# Altium schematic sheet BI3.SchDoc
size 420 x 297 mm; DocumentNumber: 8; SheetNumber: 8; SheetTotal: 13; DecimalNumber: СНАБ.468222.001 ЭЗ
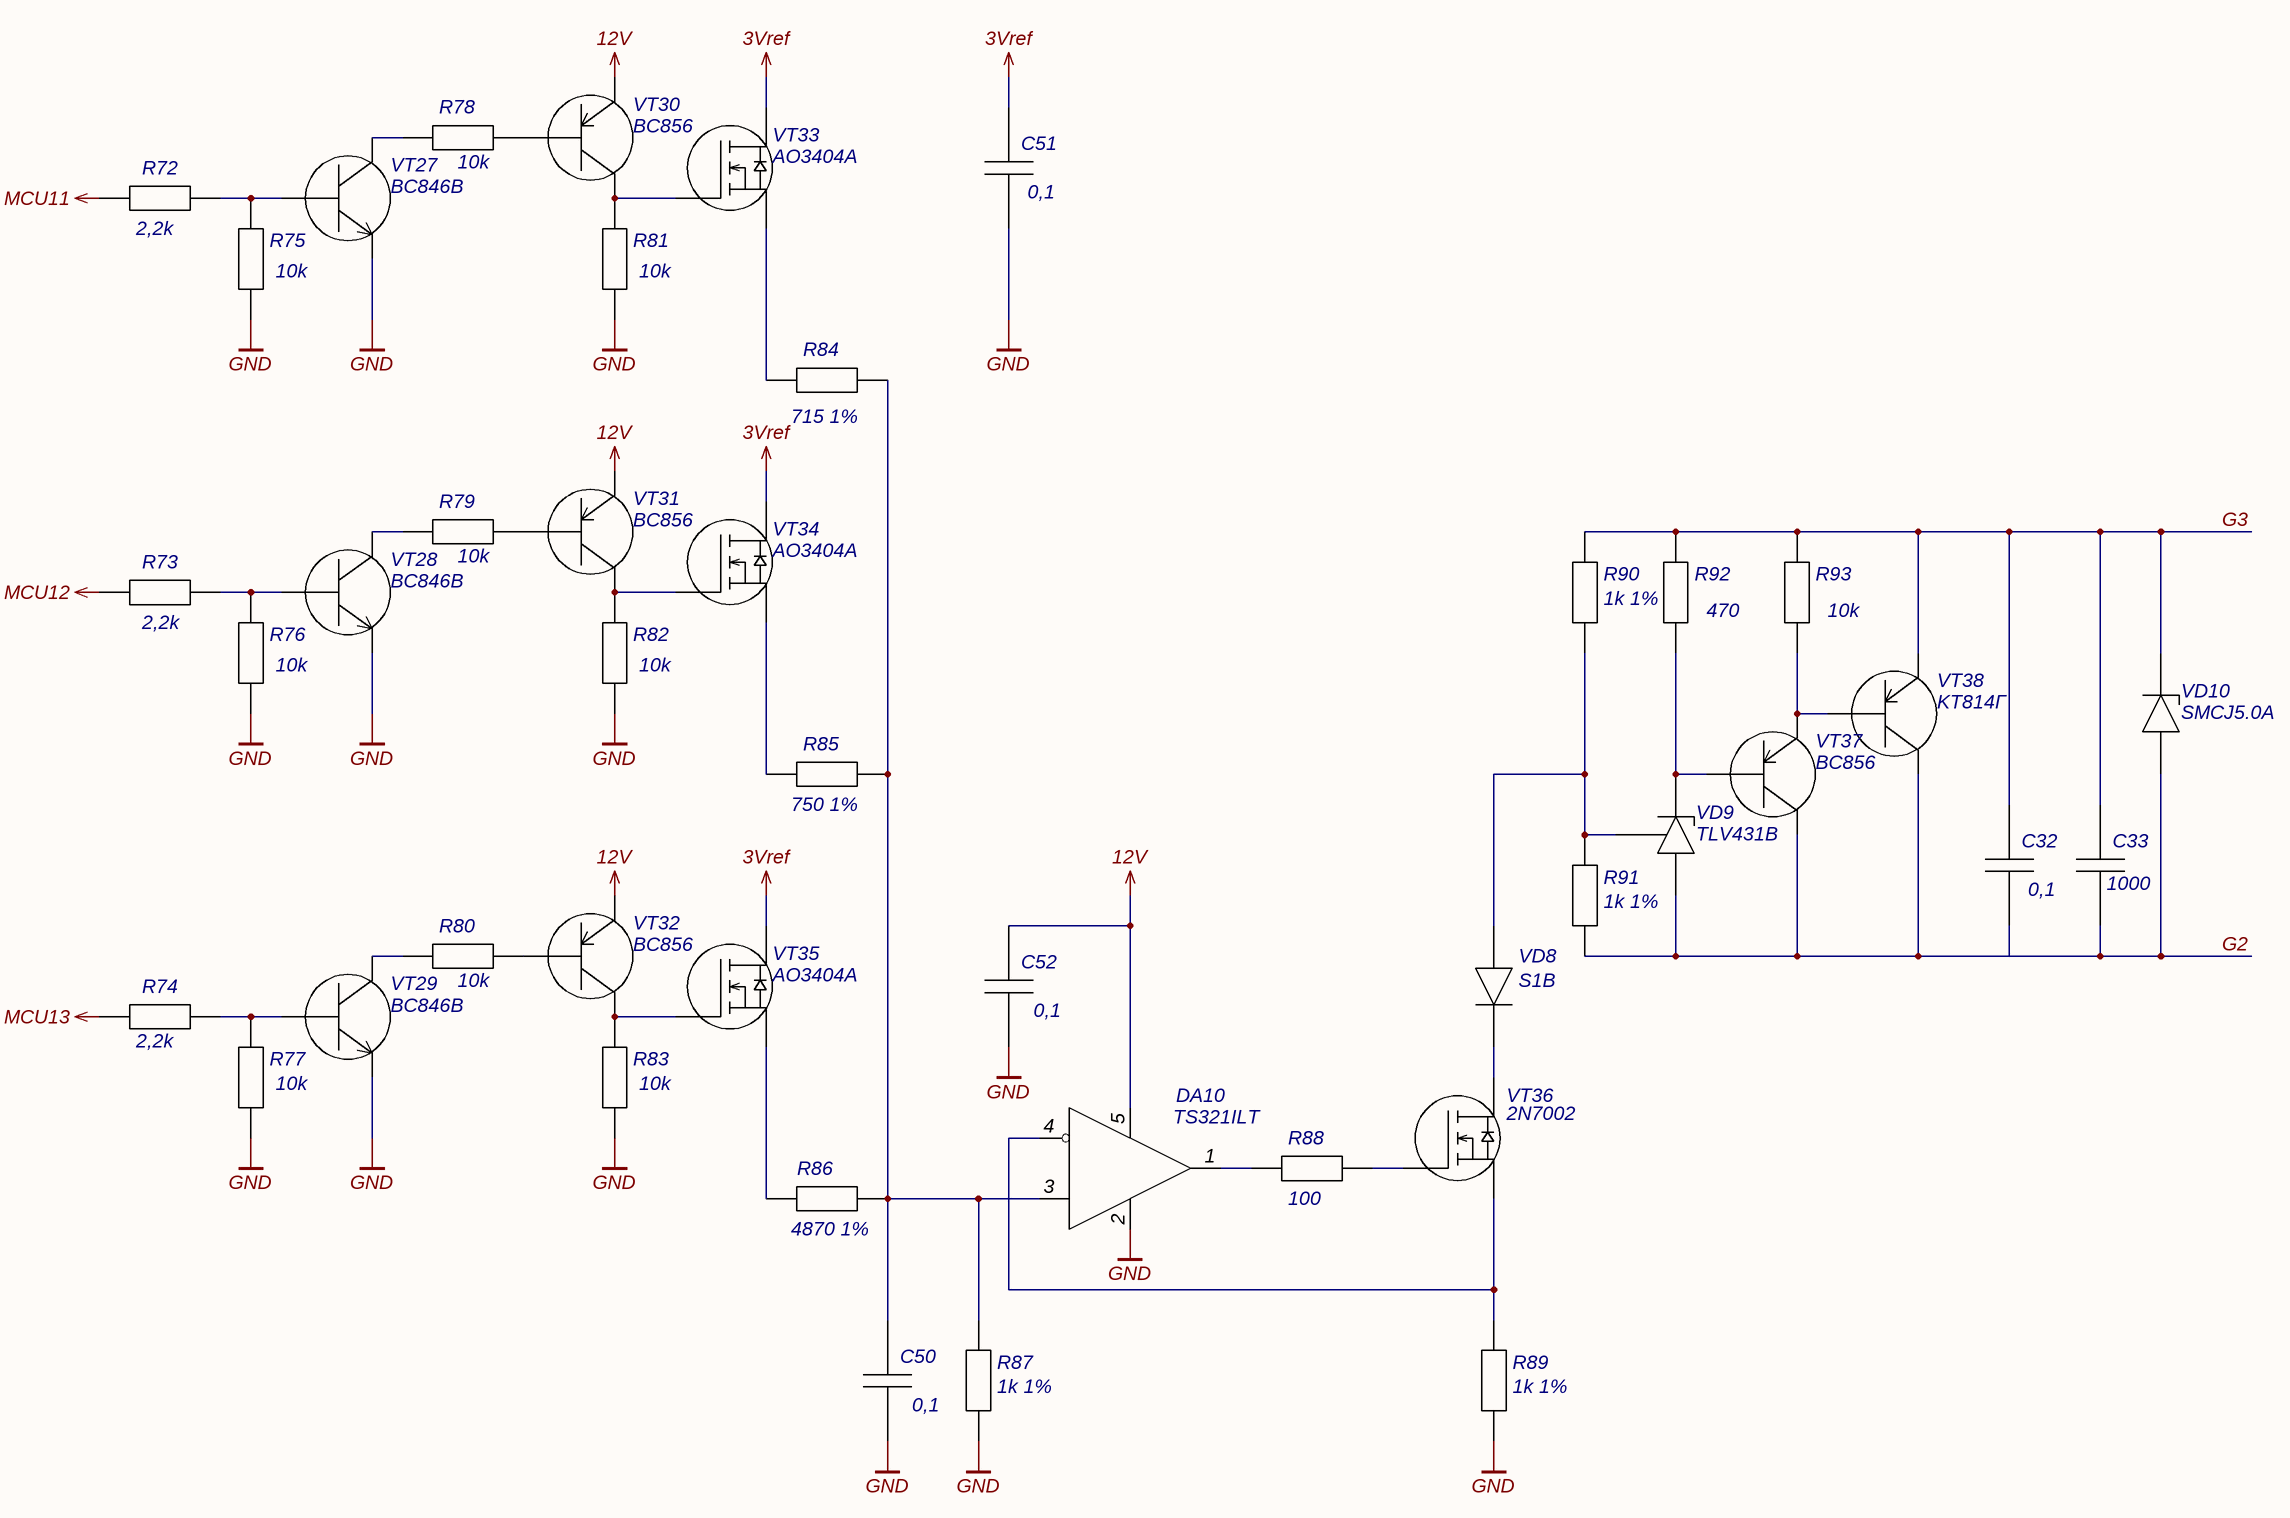
[diagram p0: BI3.SchDoc]

## Parts
C32  0,1  [C0603]
C33  1000  [C0603]
C50  0,1  [C0603]
C51  0,1  [C0603]
C52  0,1  [C0603]
DA10  TS321ILT  [SOT-23-5]
R72  2,2k  [R0603]
R73  2,2k  [R0603]
R74  2,2k  [R0603]
R75  10k  [R0603]
R76  10k  [R0603]
R77  10k  [R0603]
R78  10k  [R0603]
R79  10k  [R0603]
R80  10k  [R0603]
R81  10k  [R0603]
R82  10k  [R0603]
R83  10k  [R0603]
R84  715 1%  [R0603]
R85  750 1%  [R0603]
R86  4870 1%  [R0603]
R87  1k 1%  [R0603]
R88  100  [R0603]
R89  1k 1%  [R0603]
R90  1k 1%  [R0603]
R91  1k 1%  [R0603]
R92  470  [R0603]
R93  10k  [R0603]
VD8  S1B  [DO-214AC]
VD9  TLV431B  [SOT-23]
VD10  SMCJ5.0A  [DO-214AB]
VT27  BC846B  [SOT-23]
VT28  BC846B  [SOT-23]
VT29  BC846B  [SOT-23]
VT30  BC856  [SOT-23]
VT31  BC856  [SOT-23]
VT32  BC856  [SOT-23]
VT33  AO3404A  [SOT-23]
VT34  AO3404A  [SOT-23]
VT35  AO3404A  [SOT-23]
VT36  2N7002  [SOT-23]
VT37  BC856  [SOT-23]
VT38  KT814Г  [TO-126]

## Nets
3Vref: C51.2 VT33.2(D) VT34.2(D) VT35.2(D)
12V: C52.2 DA10.5(Vcc) VT30.1 VT31.1 VT32.1
GND: C50.1 C51.1 C52.1 DA10.2(GND) R75.1 R76.1 R77.1 R81.1 R82.1 R83.1 R87.1 R89.1 VT27.2(E) VT28.2(E) VT29.2(E)
MCU11: R72.1
MCU12: R73.1
MCU13: R74.1
G2: C32.1 C33.1 R91.1 VD9.1 VD10.1 VT37.2 VT38.2
G3: C32.2 C33.2 R90.2 R92.2 R93.2 VD10.2 VT38.1
NetC50_2: C50.2 DA10.3(+) R84.2 R85.2 R86.2 R87.2
NetDA10_1: DA10.1(OUT) R88.1
NetDA10_4: DA10.4(-) R89.2 VT36.3(S)
NetR72_2: R72.2 R75.2 VT27.1(B)
NetR73_2: R73.2 R76.2 VT28.1(B)
NetR74_2: R74.2 R77.2 VT29.1(B)
NetR78_1: R78.1 VT27.3(C)
NetR78_2: R78.2 VT30.3
NetR79_1: R79.1 VT28.3(C)
NetR79_2: R79.2 VT31.3
NetR80_1: R80.1 VT29.3(C)
NetR80_2: R80.2 VT32.3
NetR81_2: R81.2 VT30.2 VT33.1(G)
NetR82_2: R82.2 VT31.2 VT34.1(G)
NetR83_2: R83.2 VT32.2 VT35.1(G)
NetR84_1: R84.1 VT33.3(S)
NetR85_1: R85.1 VT34.3(S)
NetR86_1: R86.1 VT35.3(S)
NetR88_2: R88.2 VT36.1(G)
NetR90_1: R90.1 R91.2 VD8.1 VD9.3
NetR92_1: R92.1 VD9.2 VT37.3
NetR93_1: R93.1 VT37.1 VT38.3
NetVD8_2: VD8.2 VT36.2(D)

## Notes on the sheet
- Подп. и дата
- Инв.№ дубл.
- Взам.инв.№
- Подп.и дата
- Инв.№ подл.
- Изм.
- Лист
- № докум.
- Подп.
- Дата
- Копировал
- Формат  A3

## Library data of the parts
C32 C33 C50-C52 = Chip Capasitor: Чип-конденсатор
  C32 C50-C52: Value: 0,1
  C33: Value: 1000
DA10 = TS321ILT: 1х Операционный усилитель; Manufacurer: STMicroelectronics; Case: SOT-23-5; Name: TS321ILT; Datasheet: https://static.chipdip.ru/lib/710/DOC011710227.pdf
R72-R83 R88 R92 R93 = Chip Resistor: Чип-резистор
  R72-R74: Value: 2,2k
  R75-R83 R93: Value: 10k
  R88: Value: 100
  R92: Value: 470
R84 = Chip Resistor: Чип-резистор; Partnumber: RC0603FR-07715RL; Value: 715 1%; URL: https://www.chipdip.ru/product0/8002000768
R85 = Chip Resistor: Чип-резистор; Partnumber: RC0603FR-07750RL; Value: 750 1%; URL: https://www.chipdip.ru/product/0.1w-0603-750-om-1
R86 = Chip Resistor: Чип-резистор; Partnumber: RC0603FR-074K87L; Value: 4870 1%; URL: https://www.chipdip.ru/product0/8002000679
R87 R89-R91 = Chip Resistor: Чип-резистор; Partnumber: CRCW06031K00FKEAC; Value: 1k 1%; URL: https://www.chipdip.ru/product0/8002019285
VD8 = S1B: Диод выпрямительный, 100В; Manufacturer: Diotec Semiconductor; Case: DO-214AC; Name: S1B; Datasheet: https://static.chipdip.ru/lib/113/DOC032113174.pdf
VD9 = TLV431B: Стабилитрон регулируемый, 6В; Manufacturer: Texas Instruments; Case: SOT-23; Name: TLV431B; Datasheet: https://static.chipdip.ru/lib/985/DOC012985043.pdf
VD10 = SMCJ5.0A: Защитный диод, 5В; Manufacturer: UTD Semiconductor Co.,Ltd; Case: DO-201; Name: SMCJ5.0A; Datasheet: https://static.chipdip.ru/lib/863/DOC025863760.pdf
VT27-VT29 = BC846B: Транзистор биполярный NPN, 65В; Manufacturer: Nexperia B.V.; Case: SOT-23; Name: BC846B; Datasheet: https://static.chipdip.ru/lib/551/DOC012551042.pdf
VT30-VT32 VT37 = BC856: Транзистор биполярный PNP, 65В; Manufacturer: Nexperia; Case: SOT-23; Name: BC856; Datasheet: https://static.chipdip.ru/lib/365/DOC004365998.pdf
VT33-VT35 = AO3404A: Транзистор MOSFET N-канал, 30В; Manufacturer: UTD Semiconductor Co.,Ltd; Case: SOT-23; Name: AO3404A; Datasheet: https://static.chipdip.ru/lib/906/DOC012906979.pdf
VT36 = 2N7002: Транзистор MOSFET N-канал, 60В; Manufacturer: UTD Semiconductor Co.; Case: SOT-23; Name: 2N7002; Datasheet: https://static.chipdip.ru/lib/301/DOC021301072.pdf
VT38 = KT814Г: Транзистор биполярный PNP, 100В; Manufacturer: АО «ГРУППА КРЕМНИЙ ЭЛ»; TU: аАО.336.184 ТУ/02; Case: TO-126; Name: KT814Г; Datasheet: https://static.chipdip.ru/lib/404/DOC047404057.pdf